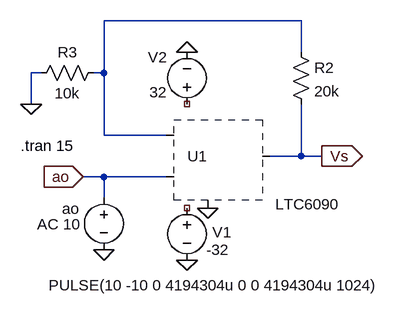
[diagram p0: schematic Ampli_vertical_sans_capa.asc]
Ampli_vertical_sans_capa.asc, the LTspice schematic file:
Version 4
SHEET 1 880 680
WIRE 368 -48 64 -48
WIRE 368 0 368 -48
WIRE -32 32 -48 32
WIRE 64 32 64 -48
WIRE 64 32 48 32
WIRE -48 80 -48 32
WIRE 64 128 64 32
WIRE 160 128 64 128
WIRE 368 160 368 80
WIRE 368 160 320 160
WIRE 400 160 368 160
WIRE 64 192 32 192
WIRE 160 192 64 192
WIRE 64 224 64 192
FLAG -48 80 0
FLAG 192 0 0
FLAG 192 320 0
FLAG 224 240 0
FLAG 64 304 0
FLAG 400 160 Vs
IOPIN 400 160 Out
FLAG 32 192 ao
IOPIN 32 192 In
SYMBOL OpAmps\\LTC6090 224 160 R0
WINDOW 0 -31 0 Left 2
SYMATTR InstName U1
SYMBOL res 352 -16 R0
SYMATTR InstName R2
SYMATTR Value 20k
SYMBOL res -48 48 R270
WINDOW 0 32 56 VTop 2
WINDOW 3 0 56 VBottom 2
SYMATTR InstName R3
SYMATTR Value 10k
SYMBOL voltage 192 224 R0
WINDOW 123 0 0 Left 0
WINDOW 39 0 0 Left 0
WINDOW 0 39 53 Left 2
WINDOW 3 30 80 Left 2
SYMATTR InstName V1
SYMATTR Value -32
SYMBOL voltage 192 96 R180
WINDOW 0 31 88 Left 2
WINDOW 3 31 34 Left 2
WINDOW 123 0 0 Left 0
WINDOW 39 0 0 Left 0
SYMATTR InstName V2
SYMATTR Value 32
SYMBOL voltage 64 208 R0
WINDOW 3 -85 151 Left 2
WINDOW 123 -103 57 Left 2
WINDOW 39 0 0 Left 0
WINDOW 0 -64 33 Left 2
SYMATTR Value PULSE(10 -10 0 4194304u 0 0 4194304u 1024)
SYMATTR Value2 AC 10
SYMATTR InstName ao
TEXT -64 144 Left 2 !.tran 15

The netlist it stands for:
* Ampli_vertical_sans_capa.asc
* U1: LTC6090 (symbol OpAmps\LTC6090 not available, pin order unknown); nets seen at it: 0, ao, N001, Vs
R2 N001 Vs 20k
R3 0 N001 10k
V1 NC_01 0 -32
V2 NC_02 0 32
V§ao ao 0 PULSE(10 -10 0 4194304u 0 0 4194304u 1024) AC 10
.tran 15
.backanno
.end